# EAGLE design Single Encoder Breakout (EAGLE 9.6.2)
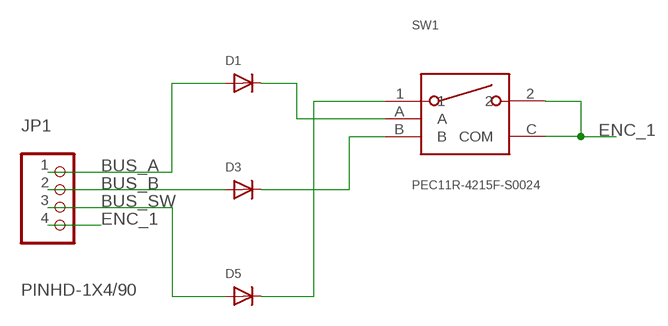
[diagram p0: schematic, sheet 1]

## Parts
D1  DIODESOD-123  [SOD-123]
D3  DIODESOD-123  [SOD-123]
D5  DIODESOD-123  [SOD-123]
JP1  PINHD-1X4/90  [1X04/90]
SW1  PEC11R-4215F-S0024  [PEC11R-4215F-S0024]

## Nets
BUS_A: D1.A JP1.1
BUS_B: D3.A JP1.2
BUS_SW: D5.A JP1.3
ENC_1: JP1.4 SW1.2 SW1.C(COM)
N$1: D1.C SW1.A
N$3: D3.C SW1.B
N$5: D5.C SW1.1

## Library data of the parts
D1 D3 D5 = adafruit:DIODE: Diode SMADIODE - SMA Surface Mount Package 20V 1A Schottky Diode Digikey: 641-1014-6-ND DO-1N4148 - Through Hole Small Current Diode SOD-123 20V 1 A (.5mV Vf) Schottky Diode - Digikey: MBRX120TPMSCT-ND SOD-323 10V 570mA (.38mV Vf, 3ns) Schottky Diode - Digikey: ZLLS410CT-ND SOD-523 30V 30mA Schottky Diode (RB751S-40TE61) - Digikey: RB751S-40TE61CT-ND SOT23-R/W - SOT23 Package (R = Solder Paste/Reflow Ovens, W = Hand-Soldering) BAT54Film 40V 300mA - Digikey: 497-7162-1-ND
JP1 = Connector:PINHD-1X4: PIN HEADER; CATEGORY: CONNECTOR; SUB-CATEGORY: PIN-HEADER
SW1 = Switch:PEC11R-4215F-S0024: ROTARY ENCODER MECHANICAL 24PPR Manufacturer's datasheet <https://www.bourns.com/docs/Product-Datasheets/PEC11R.pdf>; CREATED_BY: PCBLayout.com; DIGIKEY_PART_NUMBER: PEC11R-4215F-S0024-ND; MANUFACTURER: Bourns Inc.; MPN: PEC11R-4215F-S0024

## Board
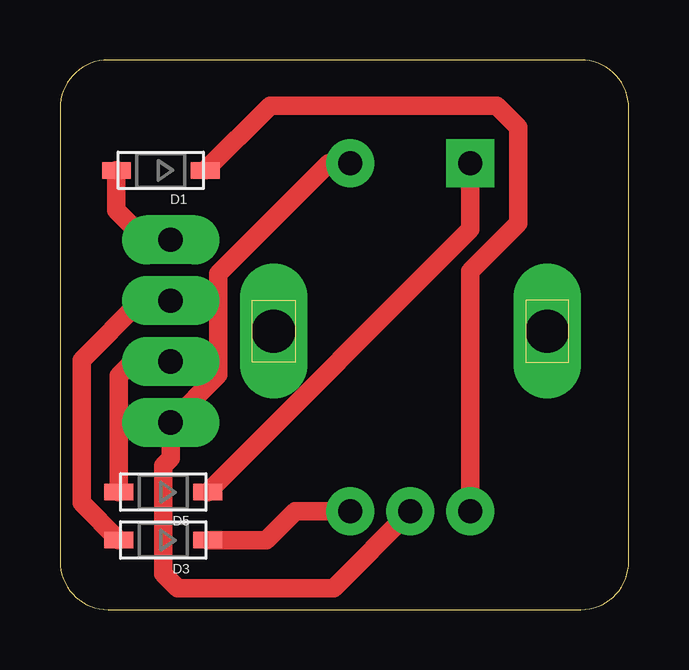
[diagram p1: board, top side]
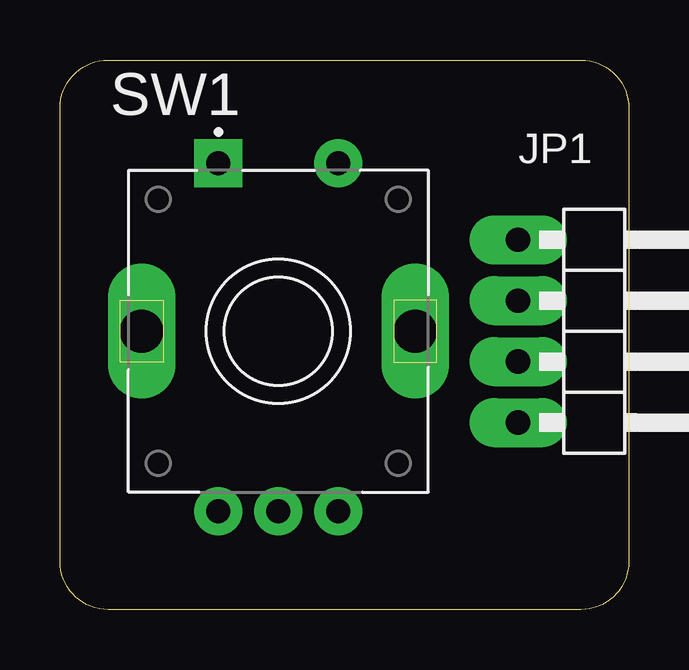
[diagram p2: board, bottom side, seen from below]

Size 23.7 x 22.9 mm. Coordinates in mm from the lower left corner, seen from the top.
Outline: 21.7,22.9 2,22.9 arc90 0,20.9 0,2 arc90 2,0 21.7,0 arc90 23.7,2 23.7,20.9 arc90 21.7,22.9
Copper layers (1*16): Top 0.035mm / dielectric 1.5mm / Bottom 0.035mm
Design rules "swidzi_milling_3018_smd_test": minimum track width 20mil, minimum drill 0.8mm, track to track 0.25mm, track to pad 0.25mm, pad to pad 0.25mm, via to via 6mil, smd to smd 6mil, copper to edge 15mil, drill to drill 6mil, minimum pad ring 10mil, minimum via ring 8mil, stop-mask expansion 4mil, vias tented up to drill 0mil, thermal gap 10mil

### Footprints (pad centres in the part's own frame; a part is rotated, then mirrored left to right if it is on the bottom)
SOD-123 = smd 1.2 x 0.7: A 1.85,0; C -1.85,0
1X04/90 = drill 1.016 long: 1 -3.81,-3.81; 2 -1.27,-3.81; 3 1.27,-3.81; 4 3.81,-3.81
PEC11R-4215F-S0024 = drill 1 square: 1 -2.5,7 | drill 1: 2 2.5,7; A -2.5,-7.5; B 2.5,-7.5; C 0,-7.5 | drill 1.8 long: P1 -5.7,0; P2 5.7,0

### Placement (x,y rotation side)
D1  4.2,18.3 180 top
D3  4.3,2.9 180 top
D5  4.3,4.9 180 top
JP1  0.8,11.6 270 bottom
SW1  14.6,11.6 0 bottom

### Tracks (layer width: path | path; a pad name or v marks a point on that pad's centre or on a via)
BUS_A
  Top 0.762: JP1.1 3.59,15.41 2.35,16.65 D1.A
BUS_B
  Top 0.762: JP1.2 3.37,12.87 0.9,10.4 0.9,4.45 D3.A
BUS_SW
  Top 0.762: JP1.3 3.03,10.33 2.45,9.75 D5.A
ENC_1
  Top 0.762: SW1.C 11.4,0.9 4.9,0.9 4.3,1.5 4.3,6 4.61,6.31 JP1.4 6.6,9.78 6.6,14 11.2,18.6 SW1.2
N$1
  Top 0.762: D1.C 8.75,21 18.2,21 19.1,20.1 19.1,16.1 17.1,14.1 SW1.A
N$3
  Top 0.762: D3.C 8.6,2.9 9.8,4.1 SW1.B
N$5
  Top 0.762: D5.C 17.1,15.85 SW1.1